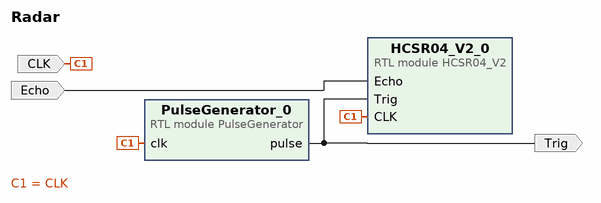
[diagram p0: block diagram of the top level]
# Vivado block design Radar, xc7a35ticpg236-1L, Vivado 2022.2
create_bd_design Radar

create_bd_port -dir I -type clk CLK
set_property -dict {CONFIG.FREQ_HZ 100000000} [get_bd_ports CLK]
create_bd_port -dir I Echo
create_bd_port -dir O Trig

create_bd_cell -type module -reference PulseGenerator PulseGenerator_0
create_bd_cell -type module -reference HCSR04_V2 HCSR04_V2_0

# ---- connections ----

connect_bd_net [get_bd_ports CLK] [get_bd_pins PulseGenerator_0/clk] [get_bd_pins HCSR04_V2_0/CLK]
connect_bd_net [get_bd_ports Echo] [get_bd_pins HCSR04_V2_0/Echo]
connect_bd_net [get_bd_pins PulseGenerator_0/pulse] [get_bd_pins HCSR04_V2_0/Trig] [get_bd_ports Trig]

validate_bd_design
save_bd_design
